# Altium schematic sheet MCU.SchDoc
size A3; SheetNumber: 3; SheetTotal: 5
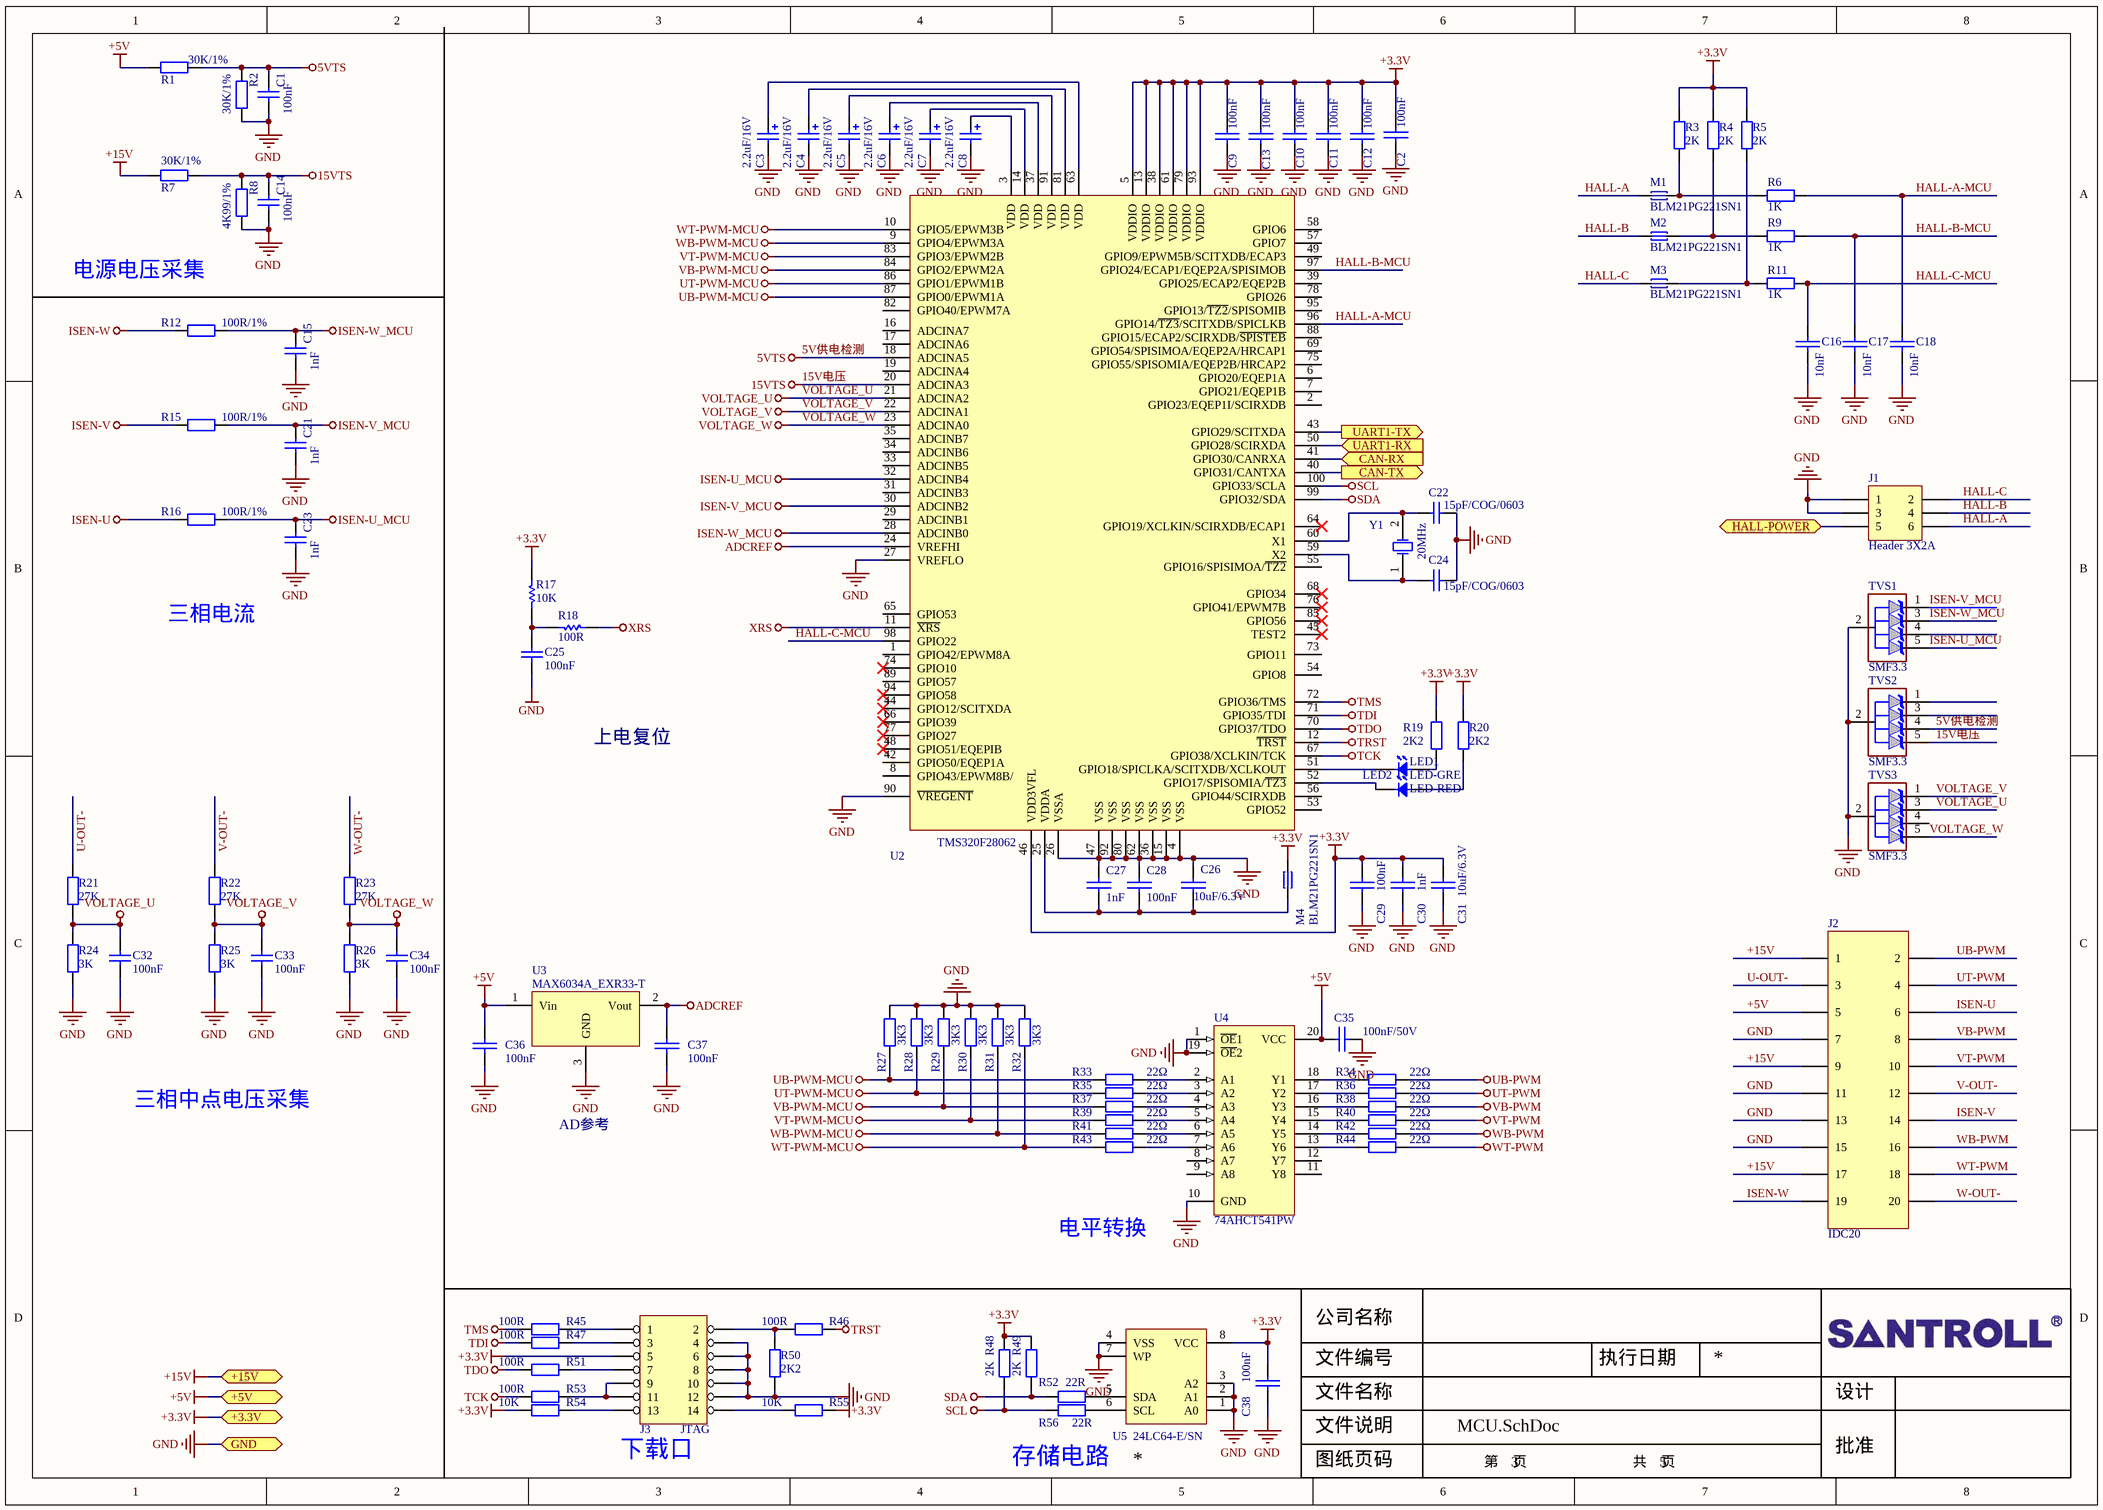
[diagram p0: MCU.SchDoc]

## Parts
C1  100nF  [0603]
C2  100nF  [0603]
C3  2.2uF/16V  [SMD3216-A]
C4  2.2uF/16V  [SMD3216-A]
C5  2.2uF/16V  [SMD3216-A]
C6  2.2uF/16V  [SMD3216-A]
C7  2.2uF/16V  [SMD3216-A]
C8  2.2uF/16V  [SMD3216-A]
C9  100nF  [0603]
C10  100nF  [0603]
C11  100nF  [0603]
C12  100nF  [0603]
C13  100nF  [0603]
C14  100nF  [0603]
C15  1nF  [0603]
C16  10nF  [0603]
C17  10nF  [0603]
C18  10nF  [0603]
C21  1nF  [0603]
C22  15pF/COG/0603  [C0603]
C23  1nF  [0603]
C24  15pF/COG/0603  [C0603]
C25  100nF  [c0603]
C26  10uF/6.3V  [0603]
C27  1nF  [0603]
C28  100nF  [0603]
C29  100nF  [c0603]
C30  1nF  [0603]
C31  10uF/6.3V  [0603]
C32  100nF  [c0603]
C33  100nF  [c0603]
C34  100nF  [c0603]
C35  100nF/50V  [0603]
C36  100nF  [0603]
C37  100nF  [0603]
C38  100nF  [0603]
J1  Header 3X2A  [2.54-6pin-针]
J2  IDC20  [2.54-20pin-针]
J3  JTAG  [2.54-14pin-针]
LED1  LED-GRE  [LED-0805]
LED2  LED-RED  [LED-0805]
M1  BLM21PG221SN1  [0805]
M2  BLM21PG221SN1  [0805]
M3  BLM21PG221SN1  [0805]
M4  BLM21PG221SN1  [0805]
R1  30K/1%  [0603]
R2  30K/1%  [0603]
R3  2K  [0603]
R4  2K  [0603]
R5  2K  [0603]
R6  1K  [0603]
R7  30K/1%  [0603]
R8  4K99/1%  [0603]
R9  1K  [0603]
R11  1K  [0603]
R12  100R/1%  [0603]
R15  100R/1%  [0603]
R16  100R/1%  [0603]
R17  10K  [0603]
R18  100R  [0603]
R19  2K2  [0805]
R20  2K2  [0805]
R21  27K  [0603]
R22  27K  [0603]
R23  27K  [0603]
R24  3K  [0603]
R25  3K  [0603]
R26  3K  [0603]
R27  3K3  [0603]
R28  3K3  [0603]
R29  3K3  [0603]
R30  3K3  [0603]
R31  3K3  [0603]
R32  3K3  [0603]
R33  22Ω  [0603]
R34  22Ω  [0603]
R35  22Ω  [0603]
R36  22Ω  [0603]
R37  22Ω  [0603]
R38  22Ω  [0603]
R39  22Ω  [0603]
R40  22Ω  [0603]
R41  22Ω  [0603]
R42  22Ω  [0603]
R43  22Ω  [0603]
R44  22Ω  [0603]
R45  100R  [0603]
R46  100R  [0603]
R47  100R  [0603]
R48  2K  [0603]
R49  2K  [0603]
R50  2K2  [0603]
R51  100R  [0603]
R52  22R  [0603]
R53  100R  [0603]
R54  10K  [0603]
R55  10K  [0603]
R56  22R  [0603]
TVS1  SMF3.3  [SC70-5L]
TVS2  SMF3.3  [SC70-5L]
TVS3  SMF3.3  [SC70-5L]
U2  TMS320F28062  [TQFP-100]
U3  MAX6034A_EXR33-T  [SC70-3L]
U4  74AHCT541PW  [TSSOP-20]
U5  24LC64-E/SN  [SOP-8]
Y1  20MHz  [XTAL1200X480X300N]

## Ports
+3.3V, +5V, +15V, CAN-RX (in), CAN-TX (out), GND, HALL-POWER, UART1-RX (in), UART1-TX (out)

## Nets
5V供电检测: C1.2 R1.1 R2.1 TVS2.4 U2.18(ADCINA5)  [also labelled 5VTS]
15V电压: C14.2 R7.1 R8.1 TVS2.5 U2.20(ADCINA3)  [also labelled 15VTS]
+3.3V: C2.1 C9.1 C10.1 C11.1 C12.1 C13.1 C29.2 C30.1 C31.1 C38.2 J3.5 M4.2 R3.2 R4.2 R5.2 R17.2 R19.2 R20.2 R48.2 R49.2 R54.1 R55.2 U2.5(VDDIO) U2.13(VDDIO) U2.38(VDDIO) U2.46(VDD3VFL) U2.61(VDDIO) U2.79(VDDIO) U2.93(VDDIO) U5.8(VCC) ; port +3.3V
+5V: C35.2 C36.1 J2.5 R1.2 U3.1(Vin) U4.20(VCC) ; port +5V
+15V: J2.1 J2.9 J2.17 R7.2 ; port +15V
ADCREF: C37.1 U2.24(VREFHI) U3.2(Vout)
GND: C1.1 C2.2 C3.2 C4.2 C5.2 C6.2 C7.2 C8.2 C9.2 C10.2 C11.2 C12.2 C13.2 C14.1 C15.1 C16.1 C17.1 C18.1 C21.1 C22.2 C23.1 C24.2 C25.1 C26.1 C27.1 C28.1 C29.1 C30.2 C31.2 C32.1 C33.1 C34.1 C35.1 C36.2 C37.2 C38.1 J1.1 J1.3 J2.7 J2.11 J2.13 J2.15 J3.4 J3.6 J3.8 J3.10 J3.12 R2.2 R8.2 R24.1 R25.1 R26.1 R27.2 R28.2 R29.2 R30.2 R31.2 R32.2 R50.1 TVS1.2 TVS2.2 TVS3.2 U2.4(VSS) U2.15(VSS) U2.26(VSSA) U2.27(VREFLO) U2.36(VSS) U2.47(VSS) U2.62(VSS) U2.80(VSS) U2.90(~{VREGENT}) U2.92(VSS) U3.3(GND) U4.1(~{OE}1) U4.10(GND) U4.19(~{OE}2) U5.1(A0) U5.2(A1) U5.3(A2) U5.4(VSS) U5.7(WP) ; port GND
ISEN-U: J2.6 R16.2
ISEN-U_MCU: C23.2 R16.1 TVS1.5 U2.32(ADCINB4)
ISEN-V: J2.14 R15.2
ISEN-V_MCU: C21.2 R15.1 TVS1.1 U2.30(ADCINB2)
ISEN-W: J2.19 R12.2
ISEN-W_MCU: C15.2 R12.1 TVS1.3 U2.28(ADCINB0)
SCL: R48.1 R56.1 U2.100(GPIO33/SCLA)
SDA: R49.1 R52.1 U2.99(GPIO32/SDA)
TCK: R53.1 U2.67(GPIO38/XCLKIN/TCK)
TDI: R47.1 U2.71(GPIO35/TDI)
TDO: R51.1 U2.70(GPIO37/TDO)
TMS: R45.1 U2.72(GPIO36/TMS)
TRST: R46.2 U2.12(~{TRST})
UB-PWM: J2.2 R34.1
UB-PWM-MCU: R27.1 R33.2 U2.87(GPIO0/EPWM1A)
UT-PWM: J2.4 R36.1
UT-PWM-MCU: R28.1 R35.2 U2.86(GPIO1/EPWM1B)
VB-PWM: J2.8 R38.1
VB-PWM-MCU: R29.1 R37.2 U2.84(GPIO2/EPWM2A)
VOLTAGE_U: C32.2 R21.1 R24.2 TVS3.3 U2.21(ADCINA2)
VOLTAGE_V: C33.2 R22.1 R25.2 TVS3.1 U2.22(ADCINA1)
VOLTAGE_W: C34.2 R23.1 R26.2 TVS3.5 U2.23(ADCINA0)
VT-PWM: J2.10 R40.1
VT-PWM-MCU: R30.1 R39.2 U2.83(GPIO3/EPWM2B)
WB-PWM: J2.16 R42.1
WB-PWM-MCU: R31.1 R41.2 U2.9(GPIO4/EPWM3A)
WT-PWM: J2.18 R44.1
WT-PWM-MCU: R32.1 R43.2 U2.10(GPIO5/EPWM3B)
XRS: R18.2 U2.11(~{XRS})
CAN-RX: U2.41(GPIO30/CANRXA) ; port CAN-RX
CAN-TX: U2.40(GPIO31/CANTXA) ; port CAN-TX
HALL-A: J1.6 M1.2
HALL-A-MCU: C18.2 R6.2 U2.96(GPIO14/~{TZ3}/SCITXDB/SPICLKB)
HALL-B: J1.4 M2.2
HALL-B-MCU: C17.2 R9.2 U2.97(GPIO24/ECAP1/EQEP2A/SPISIMOB)
HALL-C: J1.2 M3.2
HALL-C-MCU: C16.2 R11.2 U2.98(GPIO22)
HALL-POWER: J1.5 ; port HALL-POWER
U-OUT-: J2.3 R21.2
UART1-RX: U2.50(GPIO28/SCIRXDA) ; port UART1-RX
UART1-TX: U2.43(GPIO29/SCITXDA) ; port UART1-TX
V-OUT-: J2.12 R22.2
W-OUT-: J2.20 R23.2
NetC3_1: C3.1 U2.63(VDD)
NetC4_1: C4.1 U2.81(VDD)
NetC5_1: C5.1 U2.91(VDD)
NetC6_1: C6.1 U2.37(VDD)
NetC7_1: C7.1 U2.14(VDD)
NetC8_1: C8.1 U2.3(VDD)
NetC22_1: C22.1 U2.60(X1) Y1.2(OSC2)
NetC24_1: C24.1 U2.59(X2) Y1.1(OSC1)
NetC25_2: C25.2 R17.1 R18.1
NetC26_2: C26.2 C27.2 C28.2 M4.1 U2.25(VDDA)
NetJ3_1: J3.1 R45.2
NetJ3_2: J3.2 R46.1 R50.2
NetJ3_3: J3.3 R47.2
NetJ3_7: J3.7 R51.2
NetJ3_9: J3.9 J3.11 R53.2
NetJ3_13: J3.13 R54.2
NetJ3_14: J3.14 R55.1
NetLED1_1: LED1.1 R19.1
NetLED1_2: LED1.2 U2.51(GPIO18/SPICLKA/SCITXDB/XCLKOUT)
NetLED2_1: LED2.1 R20.1
NetLED2_2: LED2.2 U2.52(GPIO17/SPISOMIA/~{TZ3})
NetM1_1: M1.1 R3.1 R6.1
NetM2_1: M2.1 R4.1 R9.1
NetM3_1: M3.1 R5.1 R11.1
NetR33_1: R33.1 U4.2(A1)
NetR34_2: R34.2 U4.18(Y1)
NetR35_1: R35.1 U4.3(A2)
NetR36_2: R36.2 U4.17(Y2)
NetR37_1: R37.1 U4.4(A3)
NetR38_2: R38.2 U4.16(Y3)
NetR39_1: R39.1 U4.5(A4)
NetR40_2: R40.2 U4.15(Y4)
NetR41_1: R41.1 U4.6(A5)
NetR42_2: R42.2 U4.14(Y5)
NetR43_1: R43.1 U4.7(A6)
NetR44_2: R44.2 U4.13(Y6)
NetR52_2: R52.2 U5.5(SDA)
NetR56_2: R56.2 U5.6(SCL)

Not connected (* = marked no-connect by the designer): TVS1 4; TVS2 1 3; TVS3 4; U2 1(GPIO42/EPWM8A) 2(GPIO23/EQEP1I/SCIRXDB) 6(GPIO20/EQEP1A) 7(GPIO21/EQEP1B) 8(GPIO43/EPWM8B/) 16(ADCINA7) 17(ADCINA6) 19(ADCINA4) 29(ADCINB1) 31(ADCINB3) 33(ADCINB5) 34(ADCINB6) 35(ADCINB7) 39(GPIO25/ECAP2/EQEP2B) 42(GPIO50/EQEP1A) 44(GPIO12/SCITXDA)* 45(TEST2)* 48(GPIO51/EQEPIB)* 49(GPIO9/EPWM5B/SCITXDB/ECAP3) 53(GPIO52) 54(GPIO8) 55(GPIO16/SPISIMOA/~{TZ2}) 56(GPIO44/SCIRXDB) 57(GPIO7) 58(GPIO6) 64(GPIO19/XCLKIN/SCIRXDB/ECAP1)* 65(GPIO53) 66(GPIO39)* 68(GPIO34)* 69(GPIO54/SPISIMOA/EQEP2A/HRCAP1) 73(GPIO11) 74(GPIO10)* 75(GPIO55/SPISOMIA/EQEP2B/HRCAP2) 76(GPIO41/EPWM7B)* 77(GPIO27)* 78(GPIO26) 82(GPIO40/EPWM7A) 85(GPIO56)* 88(GPIO15/ECAP2/SCIRXDB/~{SPISTEB}) 89(GPIO57) 94(GPIO58)* 95(GPIO13/~{TZ2}/SPISOMIB); U4 8(A7) 9(A8) 11(Y8) 12(Y7)

## Notes on the sheet
- 电源电压采集
- 三相电流
- 上电复位
- 三相中点电压采集
- AD参考
- 电平转换
- (near J3) 下载口
- 存储电路
- 公司名称
- 文件编号
- 文件名称
- 执行日期
- 设计
- 文件说明
- 批准
- 图纸页码
- 第    页
- 共    页

## Library data of the parts
C1 C14 C15 C21 C23 = Cap: Capacitor; Value: 100pF; Published: 8-Jun-2000; LatestRevisionDate: 17-Jul-2002; LatestRevisionNote: Re-released for DXP Platform.; PackageReference: RAD-0.3; Publisher: Altium Limited
C2 C9-C13 C16-C18 C26-C31 C35-C38 = CAP: Capacitor
C3-C8 = Cap Pol2: Polarized Capacitor (Axial); Published: 8-Jun-2000; LatestRevisionDate: 17-Jul-2002; LatestRevisionNote: Re-released for DXP Platform.; Publisher: Altium Limited
C22 C24 = Cap: Capacitor; Value: 0805; Published: 8-Jun-2000; LatestRevisionDate: 17-Jul-2002; LatestRevisionNote: Re-released for DXP Platform.; PackageReference: RAD-0.3; Publisher: Altium Limited
C25 = Cap: value: 100nF
C32-C34 = Cap: value: 100pF
J1 = Header 3X2A: 5569-06,弯角
J3 = HEADER 7X2
LED1 LED2 = LED
M1-M4 = L
R1 R2 R7 R8 R12 R15 R16 R19 R20 R27-R56 = Res2: Resistor; Value: 1K; Published: 8-Jun-2000; LatestRevisionDate: 17-Jul-2002; LatestRevisionNote: Re-released for DXP Platform.; PackageReference: AXIAL-0.4; Publisher: Altium Limited
R3-R5 R21-R26 = R: Resistor; value: 1K
R6 R9 R11 R17 R18 = R: Resistor
  R6 R9 R11: value: 1K
  R17: value: 10K
  R18: value: 100R
TVS1-TVS3 = TVS
U2 = 28069-100PIN
U3 = VOLTREG
U4 = M74HC541B1R: Octal Bus Buffer with 3 State Outputs (Non Inverted); Published: 8-Jun-2000; LatestRevisionDate: 06-Jun-2005; LatestRevisionNote: Stylized 3D Model Added.; DatasheetVersion: Oct-1993; PackageVersion: Jun-1998; PackageReference: DIP20; Publisher: Altium Limited; PackageDescription: DIP; 20 Leads; Row Spacing 7.62 mm; Pitch 2.54 mm; Code_JEDEC: MS-015-AE; ComponentLink1Description: Manufacturer Link; ComponentLink1URL: http://www.st.com/
U5 = 24LC64-E/SN: 64Kbit, 400kHz, 2.5V, I2C Serial EEPROM, 8-Pin SOIC 150mil, Extended Temperature; Published: 29-Jan-2009; DatasheetVersion: revL, Mar-2007; PackageVersion: revAW, Oct-2008; PackageReference: SOIC-SN8; Publisher: Altium Limited; PackageDescription: 8-Lead Plastic Small Outline (SN) - Narrow, 3.90mm Body [SOIC]; Code_JEDEC: MS-012; Code_IPC: SOIC127P600-8; ComponentLink1Description: Manufacturer Link; ComponentLink1URL: http://www.microchip.com; ComponentLink2Description: Datasheet; ComponentLink2URL: http://ww1.microchip.com/downloads/en/DeviceDoc/21189L.pdf; ComponentLink3Description: Packaging Specification; ComponentLink3URL: http://ww1.microchip.com/downloads/en/PackagingSpec/00049AW.pdf
Y1 = XTAL: Crystal Oscillator; Published: 8-Jun-2000; LatestRevisionDate: 17-Jul-2002; LatestRevisionNote: Re-released for DXP Platform.; PackageReference: R38; Publisher: Altium Limited